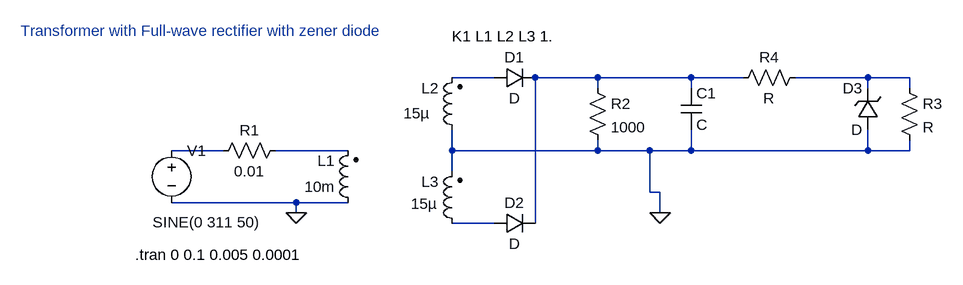
[diagram p0: schematic Lab0e3.asc]
Lab0e3.asc, the LTspice schematic file:
Version 4
SHEET 1 1208 680
WIRE 512 16 448 16
WIRE 672 16 576 16
WIRE 816 16 672 16
WIRE 896 16 816 16
WIRE 1088 16 976 16
WIRE 1152 16 1088 16
WIRE 672 32 672 16
WIRE 816 32 816 16
WIRE 1088 32 1088 16
WIRE 1152 32 1152 16
WIRE 96 128 16 128
WIRE 288 128 176 128
WIRE 448 128 448 96
WIRE 672 128 672 112
WIRE 672 128 448 128
WIRE 752 128 672 128
WIRE 816 128 816 96
WIRE 816 128 752 128
WIRE 1088 128 1088 96
WIRE 1088 128 816 128
WIRE 1152 128 1152 112
WIRE 1152 128 1088 128
WIRE 448 160 448 128
WIRE 752 192 752 128
WIRE 768 192 752 192
WIRE 208 208 16 208
WIRE 288 208 208 208
WIRE 208 224 208 208
WIRE 768 224 768 192
WIRE 512 240 448 240
WIRE 576 240 576 16
FLAG 768 224 0
FLAG 208 224 0
SYMBOL voltage 16 112 R0
WINDOW 3 -29 126 Left 2
WINDOW 123 0 0 Left 0
WINDOW 39 0 0 Left 0
SYMATTR Value SINE(0 311 50)
SYMATTR InstName V1
SYMBOL res 192 112 R90
WINDOW 0 0 56 VBottom 2
WINDOW 3 32 56 VTop 2
SYMATTR InstName R1
SYMATTR Value 0.01
SYMBOL ind2 304 224 R180
WINDOW 0 36 80 Left 2
WINDOW 3 36 40 Left 2
SYMATTR InstName L1
SYMATTR Value 10m
SYMATTR Type ind
SYMBOL ind2 464 112 R180
WINDOW 0 36 80 Left 2
WINDOW 3 50 41 Left 2
SYMATTR InstName L2
SYMATTR Value 15µ
SYMATTR Type ind
SYMBOL ind2 464 256 R180
WINDOW 0 36 80 Left 2
WINDOW 3 39 46 Left 2
SYMATTR InstName L3
SYMATTR Value 15µ
SYMATTR Type ind
SYMBOL diode 512 32 R270
WINDOW 0 32 32 VTop 2
WINDOW 3 0 32 VBottom 2
SYMATTR InstName D1
SYMBOL diode 512 256 R270
WINDOW 0 32 32 VTop 2
WINDOW 3 0 32 VBottom 2
SYMATTR InstName D2
SYMBOL res 656 16 R0
SYMATTR InstName R2
SYMATTR Value 1000
SYMBOL cap 800 32 R0
SYMATTR InstName C1
SYMBOL res 1136 16 R0
SYMATTR InstName R3
SYMBOL res 992 0 R90
WINDOW 0 0 56 VBottom 2
WINDOW 3 32 56 VTop 2
SYMATTR InstName R4
SYMBOL zener 1104 96 R180
WINDOW 0 24 64 Left 2
WINDOW 3 24 0 Left 2
SYMATTR InstName D3
TEXT -216 -56 Left 2 ;Transformer with Full-wave rectifier with zener diode
TEXT -40 288 Left 2 !.tran 0 0.1 0.005 0.0001
TEXT 448 -48 Left 2 !K1 L1 L2 L3 1.

The netlist it stands for:
* Lab0e3.asc
V1 N004 0 SINE(0 311 50)
R1 N005 N004 0.01
L1 0 N005 10m
L2 0 N001 15µ
L3 N006 0 15µ
D1 N001 N002 D
D2 N006 N002 D
R2 N002 0 1000
C1 N002 0 C
R3 N003 0 R
R4 N003 N002 R
D3 0 N003 D
.model D D
.lib standard.dio
* Transformer with Full-wave rectifier with zener diode
.tran 0 0.1 0.005 0.0001
K1 L1 L2 L3 1.
.backanno
.end